# EAGLE design TMP006 Breakout (EAGLE 6.5.0)
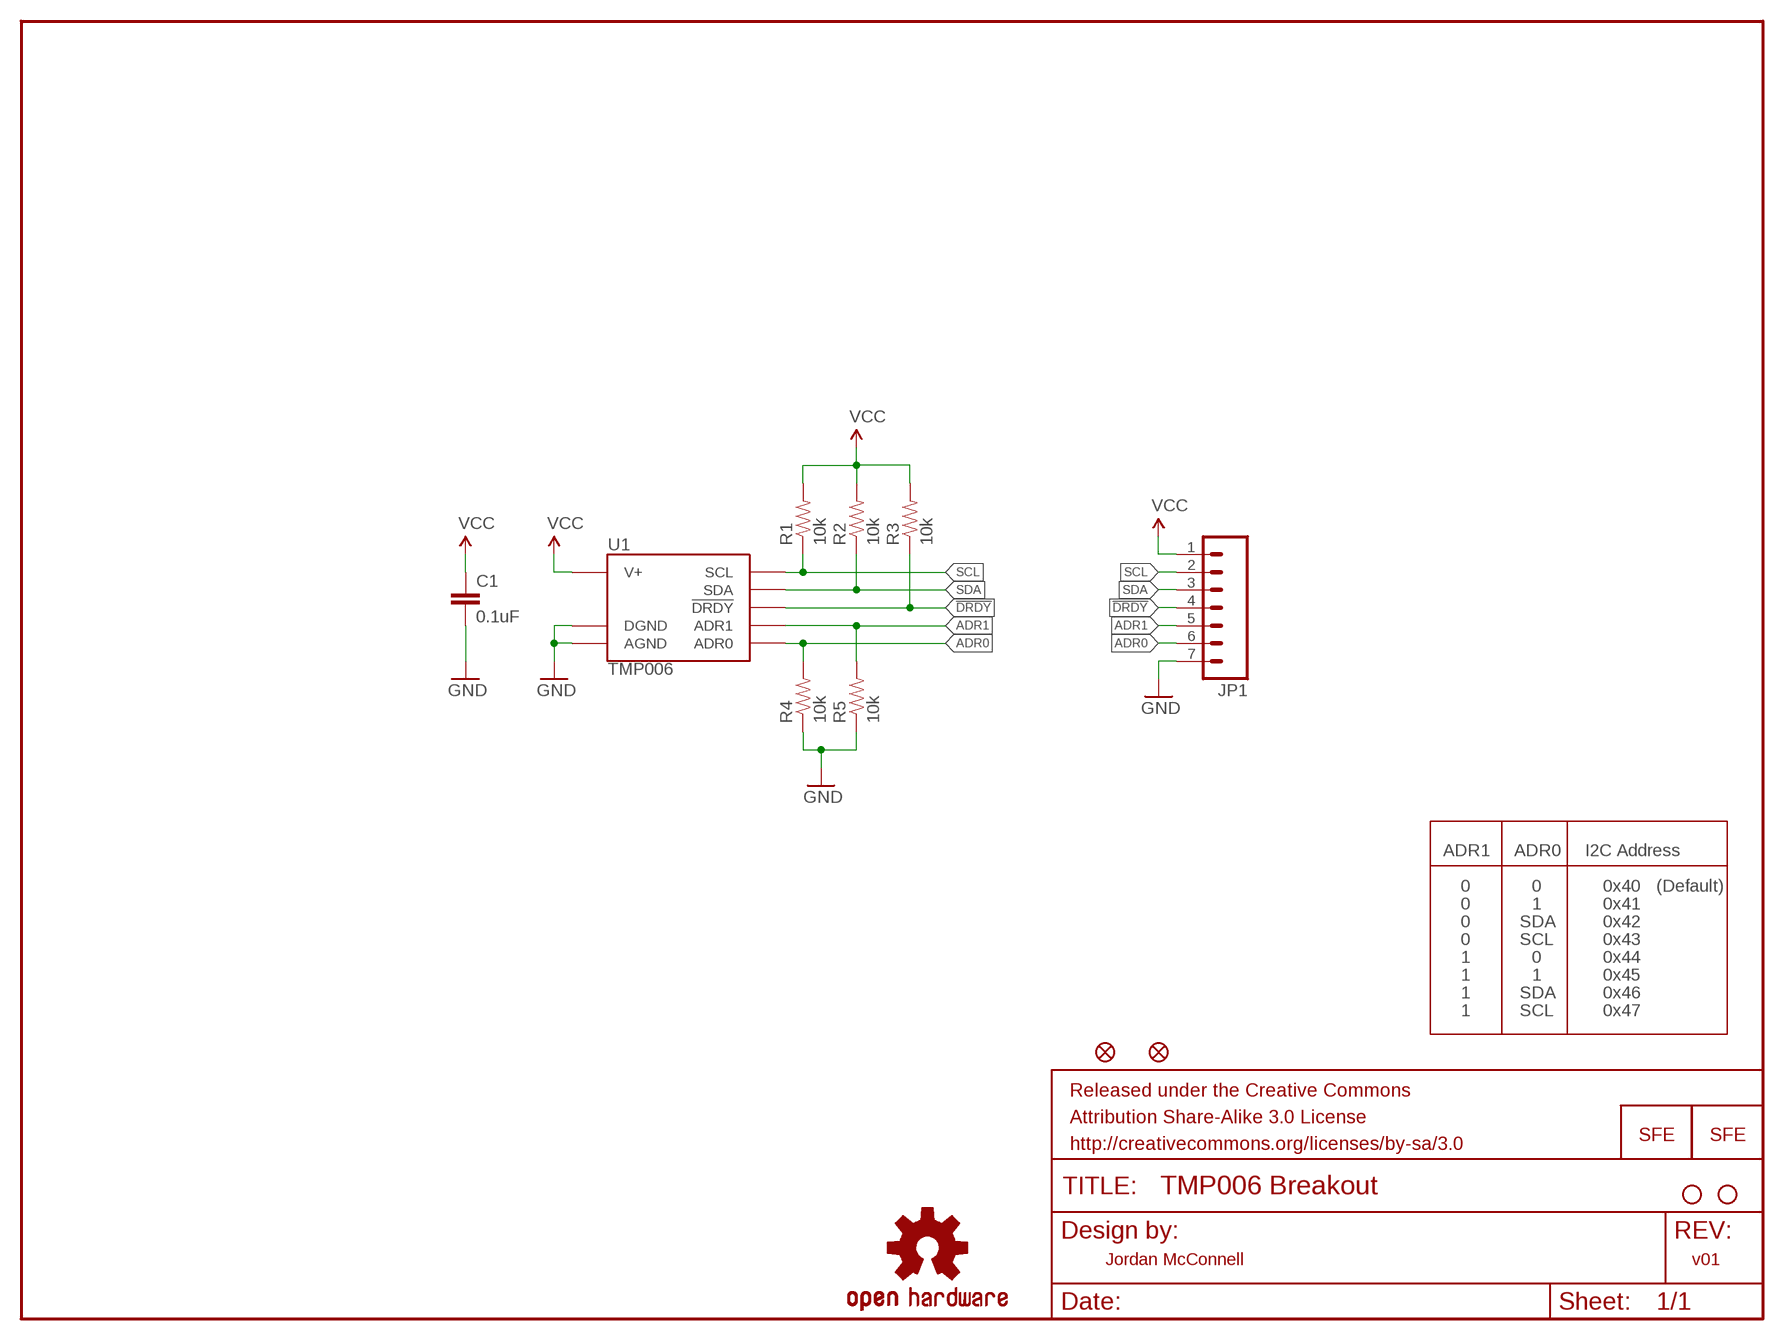
[diagram p0: schematic, sheet 1]

## Parts
C1  0.1uF  CAP0603-CAP  [0603-CAP]
FID1  FIDUCIALUFIDUCIAL  [MICRO-FIDUCIAL]
FID2  FIDUCIALUFIDUCIAL  [MICRO-FIDUCIAL]
FRAME1  FRAME-LETTER  [CREATIVE_COMMONS]
JP1  M07  [1X07]
LOGO1  LOGO-SFESK  [SFE-LOGO-FLAME]
LOGO2  OSHW-LOGOS  [OSHW-LOGO-S]
LOGO3  LOGO-SFENEW  [SFE-NEW-WEBLOGO]
R1  10k  RESISTOR0603-RES  [0603-RES]
R2  10k  RESISTOR0603-RES  [0603-RES]
R3  10k  RESISTOR0603-RES  [0603-RES]
R4  10k  RESISTOR0603-RES  [0603-RES]
R5  10k  RESISTOR0603-RES  [0603-RES]
STANDOFF1  STAND-OFF  [STAND-OFF]
STANDOFF2  STAND-OFF  [STAND-OFF]
U1  TMP006  [BGA8DS]

## Nets
!DRDY: JP1.4 R3.1 U1.C2(!DRDY)
ADR0: JP1.6 R4.2 U1.C1(ADR0)
ADR1: JP1.5 R5.2 U1.B1(ADR1)
GND: C1.2 JP1.7 R4.1 R5.1 U1.A1(DGND) U1.A2(AGND)
SCL: JP1.2 R1.1 U1.B3(SCL)
SDA: JP1.3 R2.1 U1.C3(SDA)
VCC: C1.1 JP1.1 R1.2 R2.2 R3.2 U1.A3(V+)

## Notes on the sheet
- ADR1 | ADR0 | I2C Address
- 0 | 0 | 0x40 | (Default)
- 0 | 1 | 0x41
- 0 | SDA | 0x42
- 0 | SCL | 0x43
- 1 | 0 | 0x44
- 1 | 1 | 0x45
- 1 | SDA | 0x46
- 1 | SCL | 0x47
- Jordan McConnell | v01

## Library data of the parts
C1 = SparkFun-Capacitors:CAP: Capacitor Standard 0603 ceramic capacitor, and 0.1" leaded capacitor.
FID1 FID2 = SparkFun-Aesthetics:FIDUCIAL: Fiducial Alignment Points Various fiducial points for machine vision alignment.
FRAME1 = SparkFun-Aesthetics:FRAME-LETTER: Schematic Frame Standard 8.5x11 US Letter frame
JP1 = SparkFun-Connectors:M07: Header 7 Standard 7-pin 0.1" header. Use with straight break away headers (SKU : PRT-00116), right angle break away headers (PRT-00553), swiss pins (PRT-00743), machine pins (PRT-00117), and female headers (PRT-00115). NOTES ON THE VARIANTS LOCK and LOCK_LONGPADS... This footprint was designed to help hold the alignment of a through-hole component (i.e. 7-pin header) while soldering it into place. You may notice that each hole has been shifted either up or down by 0.005 of an inch from it's more standard position (which is usually a perfectly straight line). This slight alteration caused the pins (the squares in the middle) to touch the edges of the holes. Because they are alternating, it causes a "brace" to hold the header in place. 0.005 has proven to be the perfect amount of "off-center" position when using our standard breakaway headers. Although looks a little odd when you look at the bare footprint, once you have a header in there, the alteration is very hard to notice. Also, if you push a header all the way into place, it is covered up entirely on the bottom side. This idea of altering the position of holes to aid alignment will be further integrated into the Sparkfun Library for other footprints. It can help hold any component with 3 or more connection pins.
LOGO1 LOGO3 = SparkFun-Aesthetics:LOGO-SFE: Spark Fun Electronics PCB Logo This is the standard Spark Fun Electronics PCB logo.
LOGO2 = SparkFun-Aesthetics:OSHW-LOGO: Open Source Hardware Logo This logo indicates the piece of hardware it is found on incorporates a OSHW license and/or adheres to the definition of open source hardware found here: http://freedomdefined.org/OSHW
R1-R5 = SparkFun-Resistors:RESISTOR: Resistor Basic schematic elements and footprints for 0603, 1206, and PTH resistors.
STANDOFF1 STANDOFF2 = SparkFun-Electromechanical:STAND-OFF: #4 Stand Off This is the mechanical footprint for a #4 phillips button head screw. Use the keepout ring to avoid running the screw head into surrounding components. SKU : PRT-00447
U1 = SparkFun-DigitalIC:TMP006

## Board
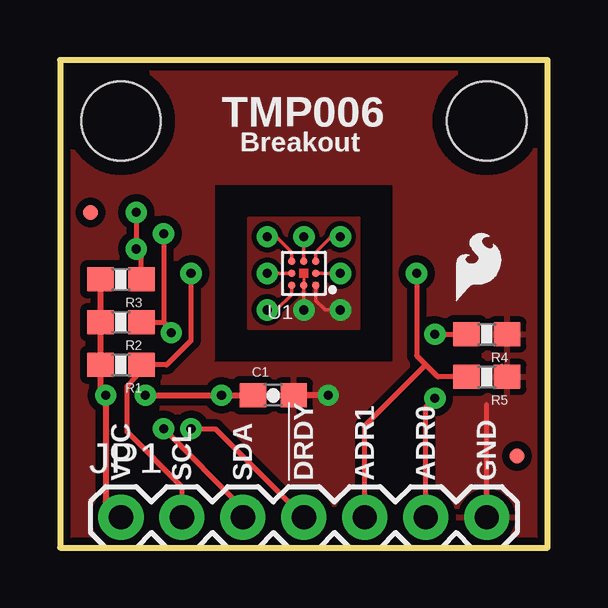
[diagram p1: board, top side]
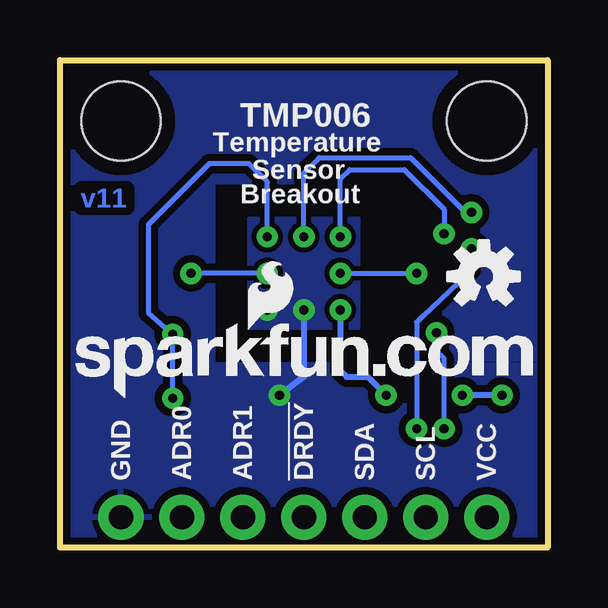
[diagram p2: board, bottom side, seen from below]

Size 20.32 x 20.32 mm. Coordinates in mm from the lower left corner, seen from the top.
Outline: 0,20.32 0,0 20.32,0 20.32,20.32 0,20.32
Copper layers (1*16): Top 0.035mm / dielectric 1.5mm / Bottom 0.035mm
Design rules "default": minimum track width 6mil, minimum drill 15mil, track to track 8mil, track to pad 8mil, pad to pad 8mil, via to via 8mil, smd to smd 8mil, copper to edge 8mil, drill to drill 8mil, minimum pad ring 12mil, minimum via ring 10mil, stop-mask expansion 4mil, vias tented up to drill 20mil, thermal gap 10mil
tRestrict: area 10.3,10.8 to 10.5,11; area 10.8,10.8 to 11,11

### Footprints (pad centres in the part's own frame; a part is rotated, then mirrored left to right if it is on the bottom)
0603-CAP = smd 1.1 x 1: 1 -0.85,0; 2 0.85,0
MICRO-FIDUCIAL = smd 0.635 x 0.635: 1 0,0
1X07 = drill 1.016 pad 1.88: 1 0,0; 2 2.54,0; 3 5.08,0; 4 7.62,0; 5 10.16,0; 6 12.7,0; 7 15.24,0
0603-RES = smd 1.1 x 1: 1 -0.85,0; 2 0.85,0
STAND-OFF = hole 3.302: 0,0
BGA8DS = smd 0.305 x 0.305: A1 0.5,-0.5; A2 0,-0.5; A3 -0.5,-0.5; B1 0.5,0; B3 -0.5,0; C1 0.5,0.5; C2 0,0.5; C3 -0.5,0.5

### Placement (x,y rotation side)
C1  8.89,6.35 0 top
FID1  1.27,13.97 0 top
FID2  19.05,3.81 0 top
FRAME1  -8.89,-13.97 0 top  (outside the outline)
JP1  2.54,1.27 0 top
LOGO1  16.51,10.29 0 top
LOGO2  2.67,11.3 0 bottom
LOGO3  19.68,6.22 0 bottom
R1  2.54,7.62 180 top
R2  2.54,9.4 180 top
R3  2.54,11.18 180 top
R4  17.78,8.89 180 top
R5  17.78,7.11 180 top
STANDOFF1  2.54,17.78 0 top
STANDOFF2  17.78,17.78 0 top
U1  10.16,11.43 0 top

### Tracks (layer width: path | path; a pad name or v marks a point on that pad's centre or on a via)
!DRDY  (via drill 0.38)
  Top 0.152: U1.C2 v10.16,12.95
  Top 0.203: v3.17,13.97 v3.17,12.45 3.39,12.23 R3.1 | v5.46,4.95 6.48,4.95 JP1.4
  Bottom 0.203: v10.16,12.95 10.16,15.62 9.53,16.26 5.71,16.26 3.43,13.97 v3.17,13.97 | v5.46,4.95 5.46,9.4 5.21,9.65 3.3,11.43 3.17,11.56 v3.17,12.45
ADR0  (via drill 0.38)
  Top 0.152: U1.C1 10.66,12.31 11.3,12.95 v11.68,12.95
  Top 0.203: JP1.6 15.24,5.84 v15.62,6.22 | v15.62,8.89 R4.2
  Bottom 0.203: v11.68,12.95 11.68,15.24 12.45,16 14.1,16 16.64,13.46 16.64,13.08 16.64,9.78 v15.62,8.89 v15.62,6.22
ADR1  (via drill 0.38)
  Top 0.152: U1.B1 v11.68,11.43
  Top 0.203: v14.86,11.43 14.86,8 15.24,7.62 | JP1.5 12.7,5.08 15.24,7.62 | R5.2 15.75,7.11 15.24,7.62
  Bottom 0.203: v11.68,11.43 v14.86,11.43
GND  (via drill 0.38)
  Top 0.152: U1.A1 10.66,10.29 11.05,9.91 v11.68,9.91 | U1.A2 v10.16,9.91 | 18.41,7.61 R5.1
  Top 0.203: JP1.7 17.78,5.97 | 18.63,6.82 R5.1
  Top 0.254: v11.18,6.35 C1.2
  Bottom 0.254: v10.16,9.91 10.16,7.11 v11.18,6.35
  pour Top: 7.87,9.14 7.87,13.72 12.45,13.72 12.45,9.14
  pour Top (isolate 0.305): 0,7.62 0,0 20.32,0 20.32,20.32 0,20.32 0,7.87 6.35,7.87 6.35,15.24 13.97,15.24 13.97,7.62
  pour Bottom (isolate 0.305): 0,7.62 0,0 20.32,0 20.32,20.32 0,20.32 0,7.87 6.35,7.87 6.35,15.24 13.97,15.24 13.97,7.62
  pour Bottom: 7.87,13.72 12.45,13.72 12.45,9.14 7.87,9.14
SCL  (via drill 0.38)
  Top 0.152: U1.B3 v8.64,11.43 | 3.32,7.49 R1.1 3.17,7.61
  Top 0.203: JP1.2 5.08,2.54 2.79,4.83 2.79,6.73 3.17,7.11 3.17,7.61 | v5.46,11.43 5.46,8.64 4.45,7.62 R1.1
  Bottom 0.203: v8.64,11.43 v5.46,11.43
SDA  (via drill 0.38)
  Top 0.152: U1.C3 9.66,12.31 9.02,12.95 v8.64,12.95
  Top 0.203: JP1.3 7.62,1.65 v4.32,4.95 | v4.32,13.08 4.32,9.4 | 4.32,9.4 4.64,9.08 v4.64,8.95 | R2.1 4.32,9.4
  Bottom 0.203: v8.64,12.95 8.64,15.37 8.26,15.75 5.97,15.75 4.32,14.1 v4.32,13.08 | v4.32,4.95 4.32,7.87 4.64,8.19 v4.64,8.95
VCC  (via drill 0.38)
  Top 0.152: U1.A3 9.66,10.55 9.02,9.91 v8.64,9.91 | 1.91,7.61 R1.2
  Top 0.254: R3.2 R2.2 R1.2 1.69,6.57 v1.91,6.35 1.91,1.91 JP1.1 | v3.56,6.35 v6.73,6.35 C1.1
  Bottom 0.254: v8.64,9.91 8.64,7.37 8.38,7.11 7.49,7.11 v6.73,6.35 | v1.91,6.35 v3.56,6.35

### Text on the board
Bottom: v11
tPlace: TMP006 | Breakout | VCC | SCL | SDA | !DRDY | ADR1 | ADR0 | GND
bPlace: TMP006 | Temperature | Sensor | Breakout | VCC | SCL | SDA | !DRDY | ADR1 | ADR0 | GND
tValues: Jordan McConnell